# Altium schematic sheet Analog - High Speed SE.SchDoc: Analog - High Speed Single Ended
size B; DrawnBy: Jasper Yun; SheetNumber: 9; SheetTotal: 13; Competition: SAC 2021; Subteam: Avionics; University: McGill University; Location: Montreal, Quebec; Project: Avionics Project Name; MRT: McGill Rocket Team
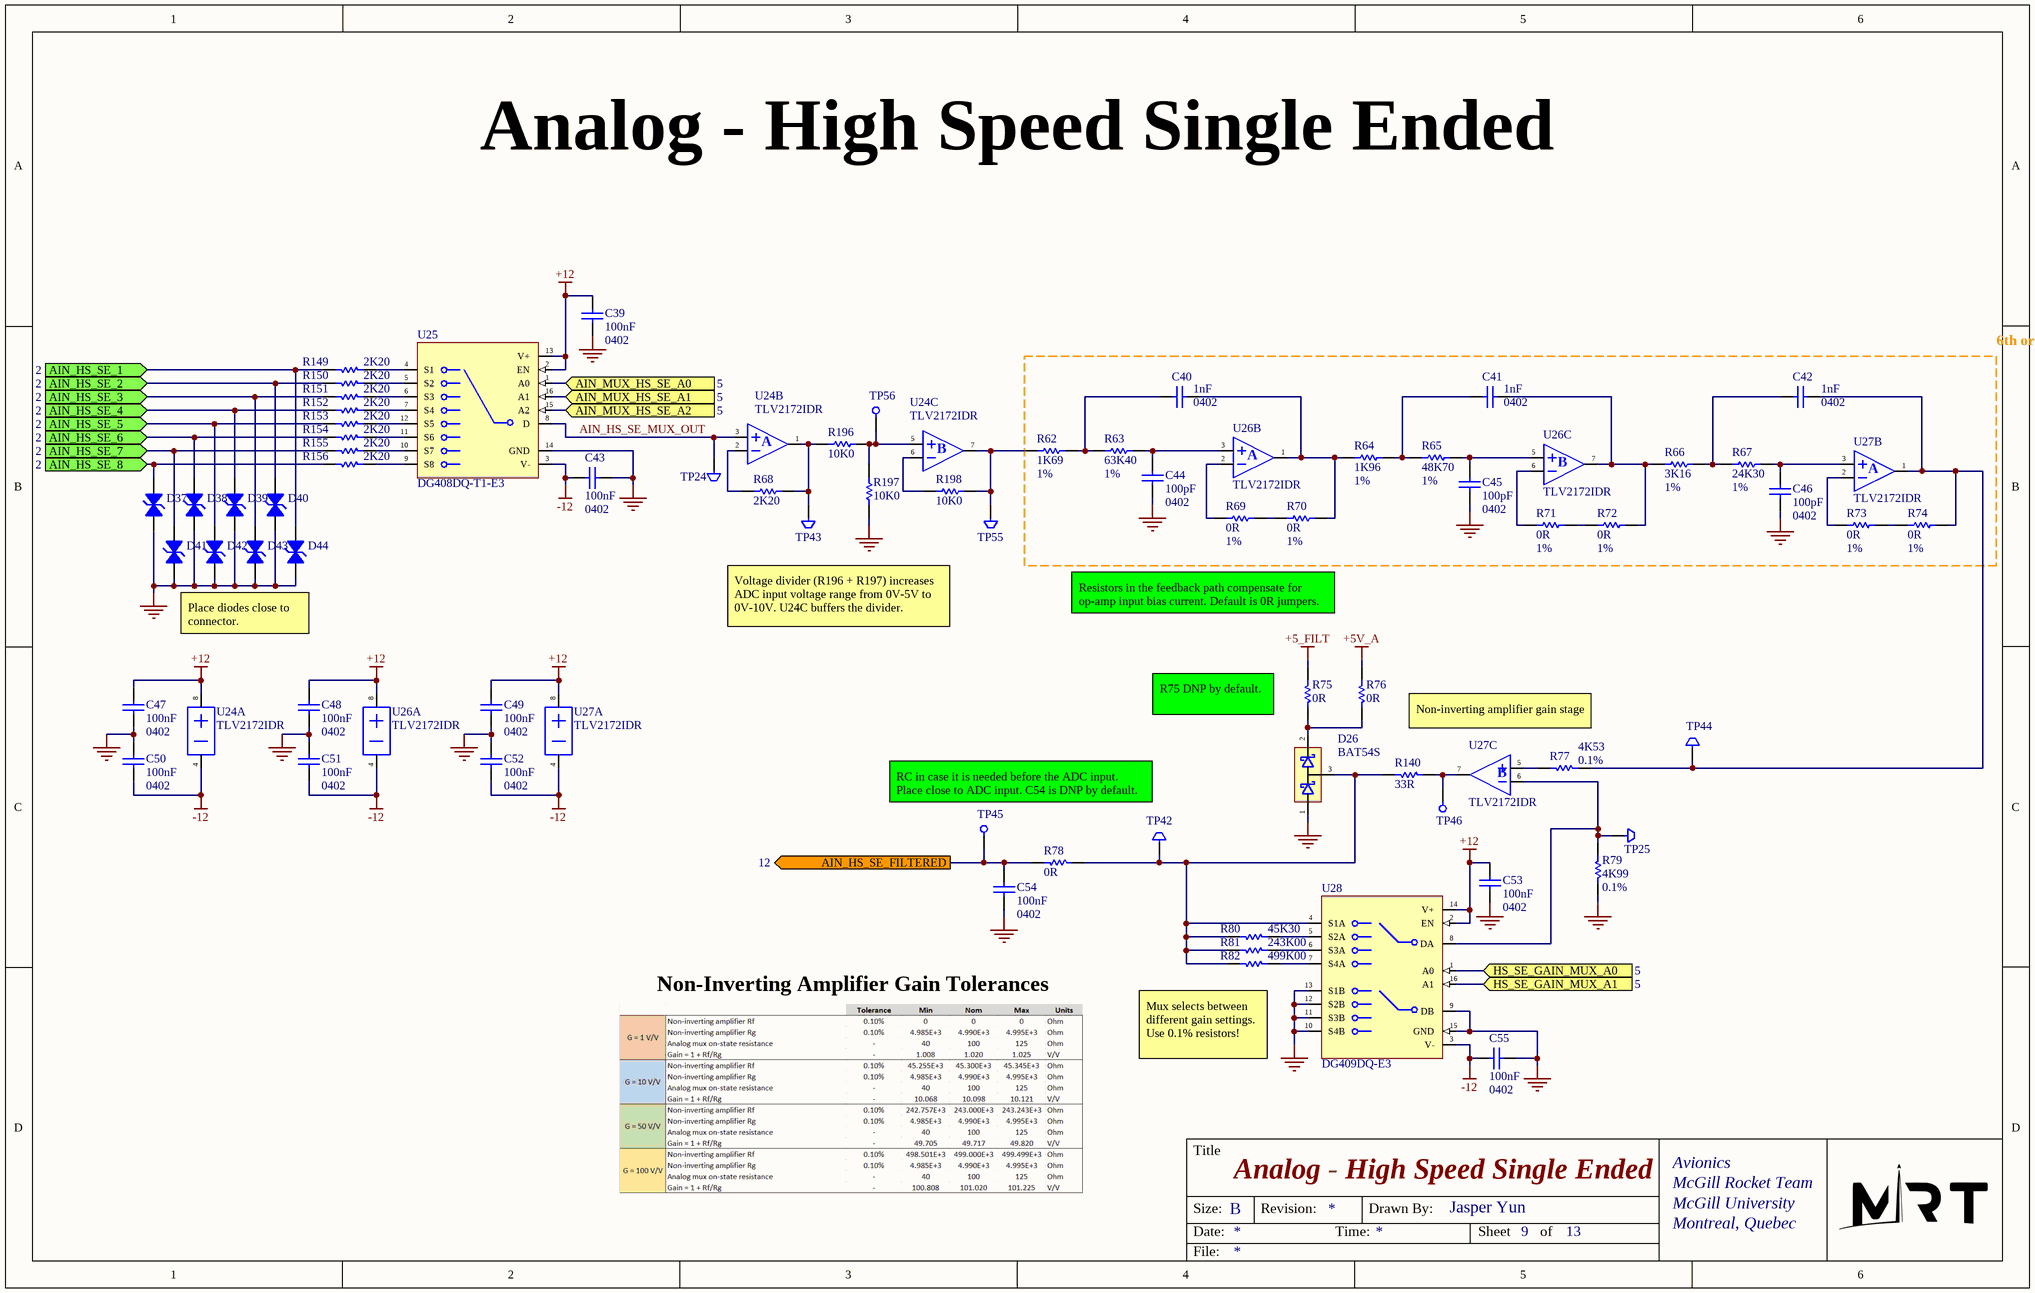
[diagram p0: Analog - High Speed SE.SchDoc]

## Parts
C39  100nF  value 0402  [0402 CAP]
C40  1nF  value 0402  [0402 CAP]
C41  1nF  value 0402  [0402 CAP]
C42  1nF  value 0402  [0402 CAP]
C43  100nF  value 0402  [0402 CAP]
C44  100pF  value 0402  [0402 CAP]
C45  100pF  value 0402  [0402 CAP]
C46  100pF  value 0402  [0402 CAP]
C47  100nF  value 0402  [0402 CAP]
C48  100nF  value 0402  [0402 CAP]
C49  100nF  value 0402  [0402 CAP]
C50  100nF  value 0402  [0402 CAP]
C51  100nF  value 0402  [0402 CAP]
C52  100nF  value 0402  [0402 CAP]
C53  100nF  value 0402  [0402 CAP]
C54  100nF  value 0402  [0402 CAP]
C55  100nF  value 0402  [0402 CAP]
D26  BAT54S  [SOT23-3]
D37  D12V0L1B2LP-7B  [DFN1006-2]  (value not drawn)
D38  D12V0L1B2LP-7B  [DFN1006-2]  (value not drawn)
D39  D12V0L1B2LP-7B  [DFN1006-2]  (value not drawn)
D40  D12V0L1B2LP-7B  [DFN1006-2]  (value not drawn)
D41  D12V0L1B2LP-7B  [DFN1006-2]  (value not drawn)
D42  D12V0L1B2LP-7B  [DFN1006-2]  (value not drawn)
D43  D12V0L1B2LP-7B  [DFN1006-2]  (value not drawn)
D44  D12V0L1B2LP-7B  [DFN1006-2]  (value not drawn)
R62  1K69  value 1%  [0402 RES]
R63  63K40  value 1%  [0402 RES]
R64  1K96  value 1%  [0402 RES]
R65  48K70  value 1%  [0402 RES]
R66  3K16  value 1%  [0402 RES]
R67  24K30  value 1%  [0402 RES]
R68  2K20  [0402 RES]
R69  0R  value 1%  [0402 RES]
R70  0R  value 1%  [0402 RES]
R71  0R  value 1%  [0402 RES]
R72  0R  value 1%  [0402 RES]
R73  0R  value 1%  [0402 RES]
R74  0R  value 1%  [0402 RES]
R75  0R  [0402 RES]
R76  0R  [0402 RES]
R77  4K53  value 0.1%  [0402 RES]
R78  0R  [0402 RES]
R79  4K99  value 0.1%  [0402 RES]
R80  45K30  [0402 RES]
R81  243K00  [0402 RES]
R82  499K00  [0402 RES]
R140  33R  [0402 RES]
R149  2K20  [0402 RES]
R150  2K20  [0402 RES]
R151  2K20  [0402 RES]
R152  2K20  [0402 RES]
R153  2K20  [0402 RES]
R154  2K20  [0402 RES]
R155  2K20  [0402 RES]
R156  2K20  [0402 RES]
R196  10K0  [0402 RES]
R197  10K0  [0402 RES]
R198  10K0  [0402 RES]
TP24  Test Point - Keystone 5015  [Test Point Keystone 5015]  (value not drawn)
TP25  Test Point - Keystone 5015  [Test Point Keystone 5015]  (value not drawn)
TP42  Test Point - Keystone 5015  [Test Point Keystone 5015]  (value not drawn)
TP43  Test Point - Keystone 5015  [Test Point Keystone 5015]  (value not drawn)
TP44  Test Point - Keystone 5015  [Test Point Keystone 5015]  (value not drawn)
TP45  Test Point - SMD Pad  [TEST POINT SMD PAD]  (value not drawn)  (no BOM)
TP46  Test Point - SMD Pad  [TEST POINT SMD PAD]  (value not drawn)  (no BOM)
TP55  Test Point - Keystone 5015  [Test Point Keystone 5015]  (value not drawn)
TP56  Test Point - SMD Pad  [TEST POINT SMD PAD]  (value not drawn)  (no BOM)
U24  TLV2172IDR  [SOIC-8]  (parts A,B,C of 3)
U25  DG408DQ-T1-E3  [TSSOP-16]
U26  TLV2172IDR  [SOIC-8]  (parts A,B,C of 3)
U27  TLV2172IDR  [SOIC-8]  (parts A,B,C of 3)
U28  DG409DQ-E3  [TSSOP-16]

## Blocks framed on the sheet
6th order Bessel Low Pass Filter (-3dB at 28kHz): C40-C42 C44-C46 R62-R67 R69-R74 U26 U27

## Ports
AIN_HS_SE_1 (in, see 2), AIN_HS_SE_2 (in, see 2), AIN_HS_SE_3 (in, see 2), AIN_HS_SE_4 (in, see 2), AIN_HS_SE_5 (in, see 2), AIN_HS_SE_6 (in, see 2), AIN_HS_SE_7 (in, see 2), AIN_HS_SE_8 (in, see 2), AIN_HS_SE_FILTERED (out, see 12), AIN_MUX_HS_SE_A0 (in, see 5), AIN_MUX_HS_SE_A1 (in, see 5), AIN_MUX_HS_SE_A2 (in, see 5), HS_SE_GAIN_MUX_A0 (in, see 5), HS_SE_GAIN_MUX_A1 (in, see 5)

## Nets
+5_FILT: R75.1
+5V_A: R76.1
+12: C39.2 C47.2 C48.2 C49.2 C53.2 U24.8(VCC+) U25.2(EN) U25.13(V+) U26.8(VCC+) U27.8(VCC+) U28.2(EN) U28.14(V+)
-12: C43.2 C50.1 C51.1 C52.1 C55.2 U24.4(VCC-) U25.3(V-) U26.4(VCC-) U27.4(VCC-) U28.3(V-)
GND: C39.1 C43.1 C44.1 C45.1 C46.1 C47.1 C48.1 C49.1 C50.2 C51.2 C52.2 C53.1 C54.1 C55.1 D26.1 D37.1 D38.1 D39.1 D40.1 D41.1 D42.1 D43.1 D44.1 R79.1 R197.1 U25.14(GND) U28.9(DB) U28.10(S4B) U28.11(S3B) U28.12(S2B) U28.13(S1B) U28.15(GND)
AIN_HS_SE_1: D44.2 R149.1 ; port AIN_HS_SE_1
AIN_HS_SE_2: D40.2 R150.1 ; port AIN_HS_SE_2
AIN_HS_SE_3: D43.2 R151.1 ; port AIN_HS_SE_3
AIN_HS_SE_4: D39.2 R152.1 ; port AIN_HS_SE_4
AIN_HS_SE_5: D42.2 R153.1 ; port AIN_HS_SE_5
AIN_HS_SE_6: D38.2 R154.1 ; port AIN_HS_SE_6
AIN_HS_SE_7: D41.2 R155.1 ; port AIN_HS_SE_7
AIN_HS_SE_8: D37.2 R156.1 ; port AIN_HS_SE_8
AIN_HS_SE_FILTERED: C54.2 R78.1 TP45.1 ; port AIN_HS_SE_FILTERED
AIN_HS_SE_MUX_OUT: TP24.1 U24.3 U25.8(D)
AIN_MUX_HS_SE_A0: U25.1(A0) ; port AIN_MUX_HS_SE_A0
AIN_MUX_HS_SE_A1: U25.16(A1) ; port AIN_MUX_HS_SE_A1
AIN_MUX_HS_SE_A2: U25.15(A2) ; port AIN_MUX_HS_SE_A2
HS_SE_GAIN_MUX_A0: U28.1(A0) ; port HS_SE_GAIN_MUX_A0
HS_SE_GAIN_MUX_A1: U28.16(A1) ; port HS_SE_GAIN_MUX_A1
NetC40_1: C40.1 R64.1 R70.2 U26.1
NetC40_2: C40.2 R62.2 R63.1
NetC41_1: C41.1 R66.1 R72.2 U26.7
NetC41_2: C41.2 R64.2 R65.1
NetC42_1: C42.1 R74.2 R77.2 TP44.1 U27.1
NetC42_2: C42.2 R66.2 R67.1
NetC44_2: C44.2 R63.2 U26.3
NetC45_2: C45.2 R65.2 U26.5
NetC46_2: C46.2 R67.2 U27.3
NetD26_2: D26.2 R75.2 R76.2
NetD26_3: D26.3 R78.2 R80.1 R81.1 R82.1 R140.1 TP42.1 U28.4(S1A)
NetR62_1: R62.1 R198.1 TP55.1 U24.7
NetR68_1: R68.1 U24.2
NetR68_2: R68.2 R196.2 TP43.1 U24.1
NetR69_1: R69.1 U26.2
NetR69_2: R69.2 R70.1
NetR71_1: R71.1 U26.6
NetR71_2: R71.2 R72.1
NetR73_1: R73.1 U27.2
NetR73_2: R73.2 R74.1
NetR77_1: R77.1 U27.5
NetR79_2: R79.2 TP25.1 U27.6 U28.8(DA)
NetR80_2: R80.2 U28.5(S2A)
NetR81_2: R81.2 U28.6(S3A)
NetR82_2: R82.2 U28.7(S4A)
NetR140_2: R140.2 TP46.1 U27.7
NetR149_2: R149.2 U25.4(S1)
NetR150_2: R150.2 U25.5(S2)
NetR151_2: R151.2 U25.6(S3)
NetR152_2: R152.2 U25.7(S4)
NetR153_2: R153.2 U25.12(S5)
NetR154_2: R154.2 U25.11(S6)
NetR155_2: R155.2 U25.10(S7)
NetR156_2: R156.2 U25.9(S8)
NetR196_1: R196.1 R197.2 TP56.1 U24.5
NetR198_2: R198.2 U24.6

## Notes on the sheet
- Place diodes close to connector.
- Voltage divider (R196 + R197) increases ADC input voltage range from 0V-5V to 0V-10V. U24C buffers the divider.
- Resistors in the feedback path compensate for op-amp input bias current. Default is 0R jumpers.
- R75 DNP by default.
- Non-inverting amplifier gain stage
- RC in case it is needed before the ADC input. Place close to ADC input. C54 is DNP by default.
- Non-Inverting Amplifier Gain Tolerances
- Mux selects between different gain settings.
  Use 0.1% resistors!
- Title
- Size:
- Date:
- B
- Revision:
- Time:
- Drawn By:
- Sheet
- of
- File:
- (in symbol OP AMP RC4580, part B) A
- (in symbol OP AMP RC4580, part C) B

## Library data of the parts
C39-C55 = Cap: Capacitor; Published: 8-Jun-2000; LatestRevisionDate: 17-Jul-2002; LatestRevisionNote: Re-released for DXP Platform.; PackageReference: RAD-0.3; Publisher: Altium Limited; PackageDescription: Radial Cap, Thru-Hole; 2 Leads; 0.3 in Pin Spacing
D26 = Schottky Diode Array BAT54S: Rectifier Diode Small Signal Schottky 40V 0.3A 5ns 3-Pin SOT-23 T/R; Manufacturer: STMicroelectronics; Manufacturer Part Number: BAT54SFILM; Forward Current: 300mA; Peak Non-Repetitive Surge Current: 1A; Forward Voltage: 900mV; Max Reverse Current: 100uA; Max Reverse Leakage Current: 1uA; Element Configuration: Single; Voltage Rating (DC): 30V; Supplier 1: Digi-Key; RoHS: Yes; Category: Rectifier Diodes; Stock 1: 2760; Pricing 1: 1=0.34000, 10=0.27800, 100=0.14730, 500=0.09694, 1000=0.06592 (USD); Mount: Surface Mount; Case/Package: SOT-23; Number of Pins: 3; Weight: 0.1lb; Min Operating Temperature: -40°C; Max Operating Temperature: 150°C; Reverse Recovery Time: 5ns; Max Repetitive Reverse Voltage (Vrrm): 40V; Packaging: Tape and Reel; Package Quantity: 3000; Average Rectified Current: 300mA; Max Forward Surge Current (Ifsm): 1A; Max Reverse Voltage (DC): 40V; Max Surge Current: 1A; Recovery Time: 5ns; Termination: SMD/SMT; Current Rating: 300mA; Length: 2.9mm; Width: 3.05mm; Height: 0.95mm; Radiation Hardening: No; REACH SVHC: No SVHC; RoHS Compliant: Yes; Lead Free: Lead Free; ComponentLink1URL: https://datasheet.ciiva.com/1200/1689724-1200683.pdf?src-supplier=Farnell; ComponentLink1Description: https://datasheet.ciiva.com/1200/1689724-1200683.pdf?src-supplier=Farnell; ComponentLink2URL: https://datasheet.ciiva.com/1177/1689724-1177974.pdf?src-supplier=Element14; ComponentLink2Description: https://datasheet.ciiva.com/1177/1689724-1177974.pdf?src-supplier=Element14; ComponentLink3URL: https://datasheet.ciiva.com/1200/cd00001322-1200682.pdf?src-supplier=Farnell; ComponentLink3Description: https://datasheet.ciiva.com/1200/cd00001322-1200682.pdf?src-supplier=Farnell; ComponentLink4URL: https://datasheet.ciiva.com/14168/cd00001322-14168028.pdf?src-supplier=Distrelec; ComponentLink4Description: https://datasheet.ciiva.com/14168/cd00001322-14168028.pdf?src-supplier=Distrelec; ComponentLink5URL: https://datasheet.ciiva.com/905/cd00001322-905882.pdf?src-supplier=Digi-Key; ComponentLink5Description: https://datasheet.ciiva.com/905/cd00001322-905882.pdf?src-supplier=Digi-Key; ComponentLink6URL: https://datasheet.ciiva.com/905/cd00001322-905881.pdf?src-supplier=Digi-Key; ComponentLink6Description: https://datasheet.ciiva.com/905/cd00001322-905881.pdf?src-supplier=Digi-Key; ComponentLink7URL: https://datasheet.ciiva.com/905/cd00001322-905883.pdf?src-supplier=Digi-Key; ComponentLink7Description: https://datasheet.ciiva.com/905/cd00001322-905883.pdf?src-supplier=Digi-Key; ComponentLink8URL: https://datasheet.ciiva.com/1177/1689724-1177973.pdf?src-supplier=Element14; ComponentLink8Description: https://datasheet.ciiva.com/1177/1689724-1177973.pdf?src-supplier=Element14; Supplier Part Number 1: 497-2522-1-ND
D37-D44 = Diode Zener Bidirectional: Bidirectional Zener diode
R62-R67 R69-R74 R77 R79 = Res1: Resistor; Published: 8-Jun-2000; LatestRevisionDate: 17-Jul-2002; LatestRevisionNote: Re-released for DXP Platform.; PackageReference: AXIAL-0.3; Publisher: Altium Limited; PackageDescription: Axial Device, Thru-Hole; 2 Leads; 0.3 in Pin Spacing
R68 R75 R76 R78 R80-R82 R140 R149-R156 R196-R198 = Res1: Resistor; Value: 1%; Published: 8-Jun-2000; LatestRevisionDate: 17-Jul-2002; LatestRevisionNote: Re-released for DXP Platform.; PackageReference: AXIAL-0.3; Publisher: Altium Limited; PackageDescription: Axial Device, Thru-Hole; 2 Leads; 0.3 in Pin Spacing
TP24 TP25 TP42-TP44 TP55 = Test Point - Keystone 5015: Keystone 5015 Test point
TP45 TP46 TP56 = Test Point - SMD Pad: SMD Pad test point
U24 U26 U27 = OP AMP RC4580: 2-channel, 12-MHz, low-noise, low-distortion audio op amp with high output current 8-SOIC -40 to 85; Manufacturer: Texas Instruments; Manufacturer Part Number: RC4580IDR; Min Supply Voltage: 4V; Max Supply Voltage: 32V; Max Dual Supply Voltage: 16V; Min Dual Supply Voltage: 2V; Voltage Gain: 110dB; Common Mode Rejection Ratio: 80dB; Nominal Gain Bandwidth Product: 12MHz; Number of Channels: 2; Slew Rate: 5V/µs; Max I/O Voltage: 3mV; Input Bias Current: 500nA; Operating Supply Current: 6mA; Output Current per Channel: 50mA; Nominal Supply Current: 4.5mA; Dual Supply Voltage: 9V; Load Impedance: 2kR; Supplier 1: Digi-Key; RoHS: Yes; Category: Amplifiers - Op Amps, Buffer, Instrumentation; Stock 1: 3503; Pricing 1: 1=0.46000, 10=0.37400, 25=0.34200, 100=0.25460, 250=0.23072, 500=0.19092, 1000=0.14320 (USD); Case/Package: D; Number of Pins: 8; Weight: 0.002561oz; Contact Plating: Gold; Min Operating Temperature: -40°C; Max Operating Temperature: 85°C; Packaging: Tape and Reel; Package Quantity: 1; Number of Circuits: 2; Gain Bandwidth Product: 12MHz; Input Offset Voltage (Vos): 3mV; Series: -; Supply Current: 4.5mA; Bandwidth: 12MHz; Unity Gain Bandwidth Product: 12MHz; Number of Elements: 2; Technology: BIPOLAR; Radiation Hardening: No; Lead Free: Lead Free; RoHS Compliant: Yes; Reach SVHC Compliant: No SVHC; ComponentLink1URL: https://datasheet.ciiva.com/23806/1716592-23806563.pdf?src-supplier=Newark; ComponentLink1Description: https://datasheet.ciiva.com/23806/1716592-23806563.pdf?src-supplier=Newark; ComponentLink2URL: https://datasheet.ciiva.com/22654/1882301-22654837.pdf?src-supplier=Element14; ComponentLink2Description: https://datasheet.ciiva.com/22654/1882301-22654837.pdf?src-supplier=Element14; ComponentLink3URL: https://datasheet.ciiva.com/46382/1840282-46382300.pdf?src-supplier=Element14; ComponentLink3Description: https://datasheet.ciiva.com/46382/1840282-46382300.pdf?src-supplier=Element14; ComponentLink4URL: https://datasheet.ciiva.com/1796/rc4580-1796261.pdf?src-supplier=Digi-Key; ComponentLink4Description: https://datasheet.ciiva.com/1796/rc4580-1796261.pdf?src-supplier=Digi-Key; ComponentLink5URL: https://datasheet.ciiva.com/1796/rc4580-1796260.pdf?src-supplier=Digi-Key; ComponentLink5Description: https://datasheet.ciiva.com/1796/rc4580-1796260.pdf?src-supplier=Digi-Key; ComponentLink6URL: https://datasheet.ciiva.com/1796/rc4580-1796262.pdf?src-supplier=Digi-Key; ComponentLink6Description: https://datasheet.ciiva.com/1796/rc4580-1796262.pdf?src-supplier=Digi-Key; Supplier Part Number 1: 296-15367-1-ND
U25 = Analog Mux DG408DQ-T1-E3: DG408DQ-T1-E3; Multiplexer Single 8: 1; 15 V; 18 V; 24 V; 28 V; 16-Pin TSSOP; Manufacturer: Vishay Siliconix; Min Supply Voltage: 13V; Max Supply Voltage: 44V; Number of Inputs: 8; Number of Outputs: 1; Operating Supply Voltage: 36V; Propagation Delay: 160ns; Max Power Dissipation: 600mW; Min Dual Supply Voltage: 5V; Max Dual Supply Voltage: 20V; Dual Supply Voltage: 15V; On-State Resistance: 90R; Turn-On Delay Time: 150ns; Max Supply Current: 500uA; Operating Supply Current: 1uA; Supply Type: Single,Dual; Nominal Supply Current: 10uA; High Level Output Current: 30mA; Supplier 1: RSComponents; Manufacturer Part Number: DG408DQ-T1-E3; RoHS: Yes; Category: Decoders and Multiplexers; Stock 1: 2985; Pricing 1: 5=2.69000, 50=2.02000, 250=1.57000 (GBP); Mount: Surface Mount; Case/Package: TSSOP; Number of Pins: 16; Weight: 0.006102oz; Contact Plating: Tin,Matte; Min Operating Temperature: -40°C; Max Operating Temperature: 85°C; Packaging: Tape and Reel; Number of Channels: 8; Package Quantity: 1; Turn-Off Delay Time: 150ns; Logic Function: Multiplexer; Power Dissipation: 600mW; Number of Circuits: 1; Series: -; Supply Current: 10uA; Length: 5.07mm; Width: 4.4mm; Height: 0.92mm; Radiation Hardening: No; Reach SVHC Compliant: Unknown; Lead Free: Lead Free; RoHS Compliant: Yes; ComponentLink1URL: https://datasheet.ciiva.com/15127/getdatasheetpartid-99309-15127097.pdf?src-supplier=Verical; ComponentLink1Description: https://datasheet.ciiva.com/15127/getdatasheetpartid-99309-15127097.pdf?src-supplier=Verical; ComponentLink2URL: https://datasheet.ciiva.com/11499/dg408-11499135.pdf?src-supplier=Avnet; ComponentLink2Description: https://datasheet.ciiva.com/11499/dg408-11499135.pdf?src-supplier=Avnet; ComponentLink3URL: https://datasheet.ciiva.com/1666/dg408-1666717.pdf?src-supplier=Digi-Key; ComponentLink3Description: https://datasheet.ciiva.com/1666/dg408-1666717.pdf?src-supplier=Digi-Key; ComponentLink4URL: https://datasheet.ciiva.com/1666/dg408-1666718.pdf?src-supplier=Digi-Key; ComponentLink4Description: https://datasheet.ciiva.com/1666/dg408-1666718.pdf?src-supplier=Digi-Key; ComponentLink5URL: https://datasheet.ciiva.com/1666/dg408-1666719.pdf?src-supplier=Digi-Key; ComponentLink5Description: https://datasheet.ciiva.com/1666/dg408-1666719.pdf?src-supplier=Digi-Key; Supplier Part Number 1: 2509481281
U28 = Analog Mux DG409DQ-E3: DG409 Series 20 V 8-Ch/Dual 4-Ch High-Performance CMOS Analog Multiplexer; Manufacturer: Vishay Siliconix; Min Supply Voltage: 13V; Max Supply Voltage: 44V; Number of Inputs: 8; Number of Outputs: 2; Number of Channels: 4; Min Dual Supply Voltage: 5V; Max Dual Supply Voltage: 20V; Propagation Delay: 160ns; On-State Resistance: 90R; Operating Supply Current: 1uA; Turn-On Delay Time: 150ns; Max Power Dissipation: 600mW; Max Supply Current: 500uA; Supply Type: Dual,Single; Dual Supply Voltage: 15V; Operating Supply Voltage: 36V; Supplier 1: Mouser; Manufacturer Part Number: DG409DQ-E3; RoHS: Yes; Category: Decoders and Multiplexers; Stock 1: 4584; Pricing 1: 1=4.36000, 10=3.91000, 50=3.70000, 100=3.20000, 1000=2.73000, 10000=2.40000 (USD); Mount: Surface Mount; Case/Package: TSSOP; Number of Pins: 16; Weight: 0.006102oz; Min Operating Temperature: -40°C; Max Operating Temperature: 85°C; Package Quantity: 360; Packaging: Rail/Tube; Logic Function: Multiplexer; Turn-Off Delay Time: 150ns; Power Dissipation: 600mW; Series: -; Length: 5.07mm; Width: 4.4mm; Height: 0.92mm; Radiation Hardening: No; Lead Free: Lead Free; RoHS Compliant: Yes; ComponentLink1URL: https://datasheet.ciiva.com/1677/dg408-1677556.pdf?src-supplier=Digi-Key; ComponentLink1Description: https://datasheet.ciiva.com/1677/dg408-1677556.pdf?src-supplier=Digi-Key; ComponentLink2URL: https://datasheet.ciiva.com/2978/dg408-2978747.pdf?src-supplier=Avnet; ComponentLink2Description: https://datasheet.ciiva.com/2978/dg408-2978747.pdf?src-supplier=Avnet; Supplier Part Number 1: 78-DG409DQ-E3